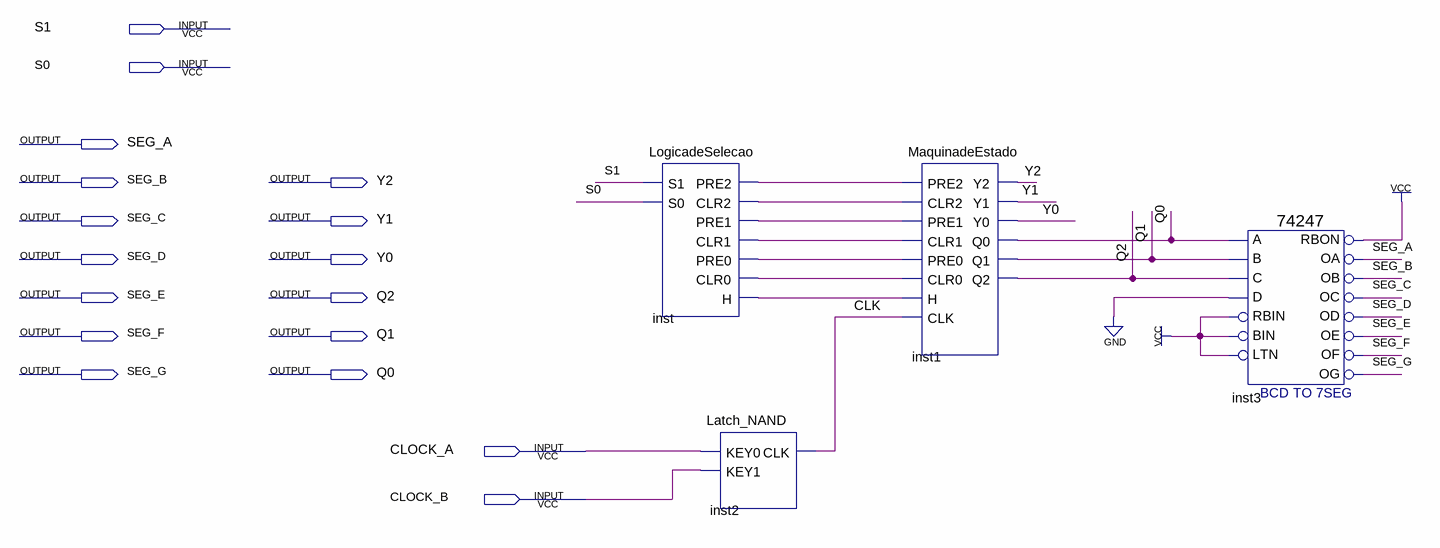
[diagram p0: schematic sheet]
// Quartus schematic projetocompleto.bdf as structural Verilog: 4 symbols, 17 pins
module projetocompleto (
  input  S1,
  input  S0,
  input  CLOCK_A,
  input  CLOCK_B,
  output SEG_A,
  output SEG_B,
  output Y2,
  output SEG_C,
  output Y1,
  output SEG_D,
  output Y0,
  output SEG_E,
  output Q2,
  output SEG_F,
  output Q1,
  output SEG_G,
  output Q0
);

  wire CLK, inst3_rbon, inst_clr0, inst_clr1, inst_clr2, inst_h, inst_pre0, inst_pre1, inst_pre2;

  LogicadeSelecao inst (
    .S1(S1), .S0(S0), .PRE2(inst_pre2), .CLR2(inst_clr2), .PRE1(inst_pre1), .CLR1(inst_clr1),
    .PRE0(inst_pre0), .CLR0(inst_clr0), .H(inst_h));
  Latch_NAND inst2 (.KEY0(CLOCK_A), .KEY1(CLOCK_B), .CLK(CLK));
  MaquinadeEstado inst1 (
    .PRE2(inst_pre2), .CLR2(inst_clr2), .PRE1(inst_pre1), .CLR1(inst_clr1), .PRE0(inst_pre0),
    .CLR0(inst_clr0), .H(inst_h), .CLK(CLK), .Y2(Y2), .Y1(Y1), .Y0(Y0), .Q2(Q2), .Q1(Q1), .Q0(Q0));
  \74247  inst3 (
    .LTN(1'b1), .BIN(1'b1), .A(Q0), .B(Q1), .RBIN(1'b1), .C(Q2), .D(1'b0), .OF(SEG_F), .OC(SEG_C),
    .OD(SEG_D), .OE(SEG_E), .RBON(inst3_rbon), .OA(SEG_A), .OB(SEG_B), .OG(SEG_G));
  // also tied to VCC on the sheet: inst3_rbon
endmodule
